# EAGLE design mainboard (EAGLE 8.2.2)
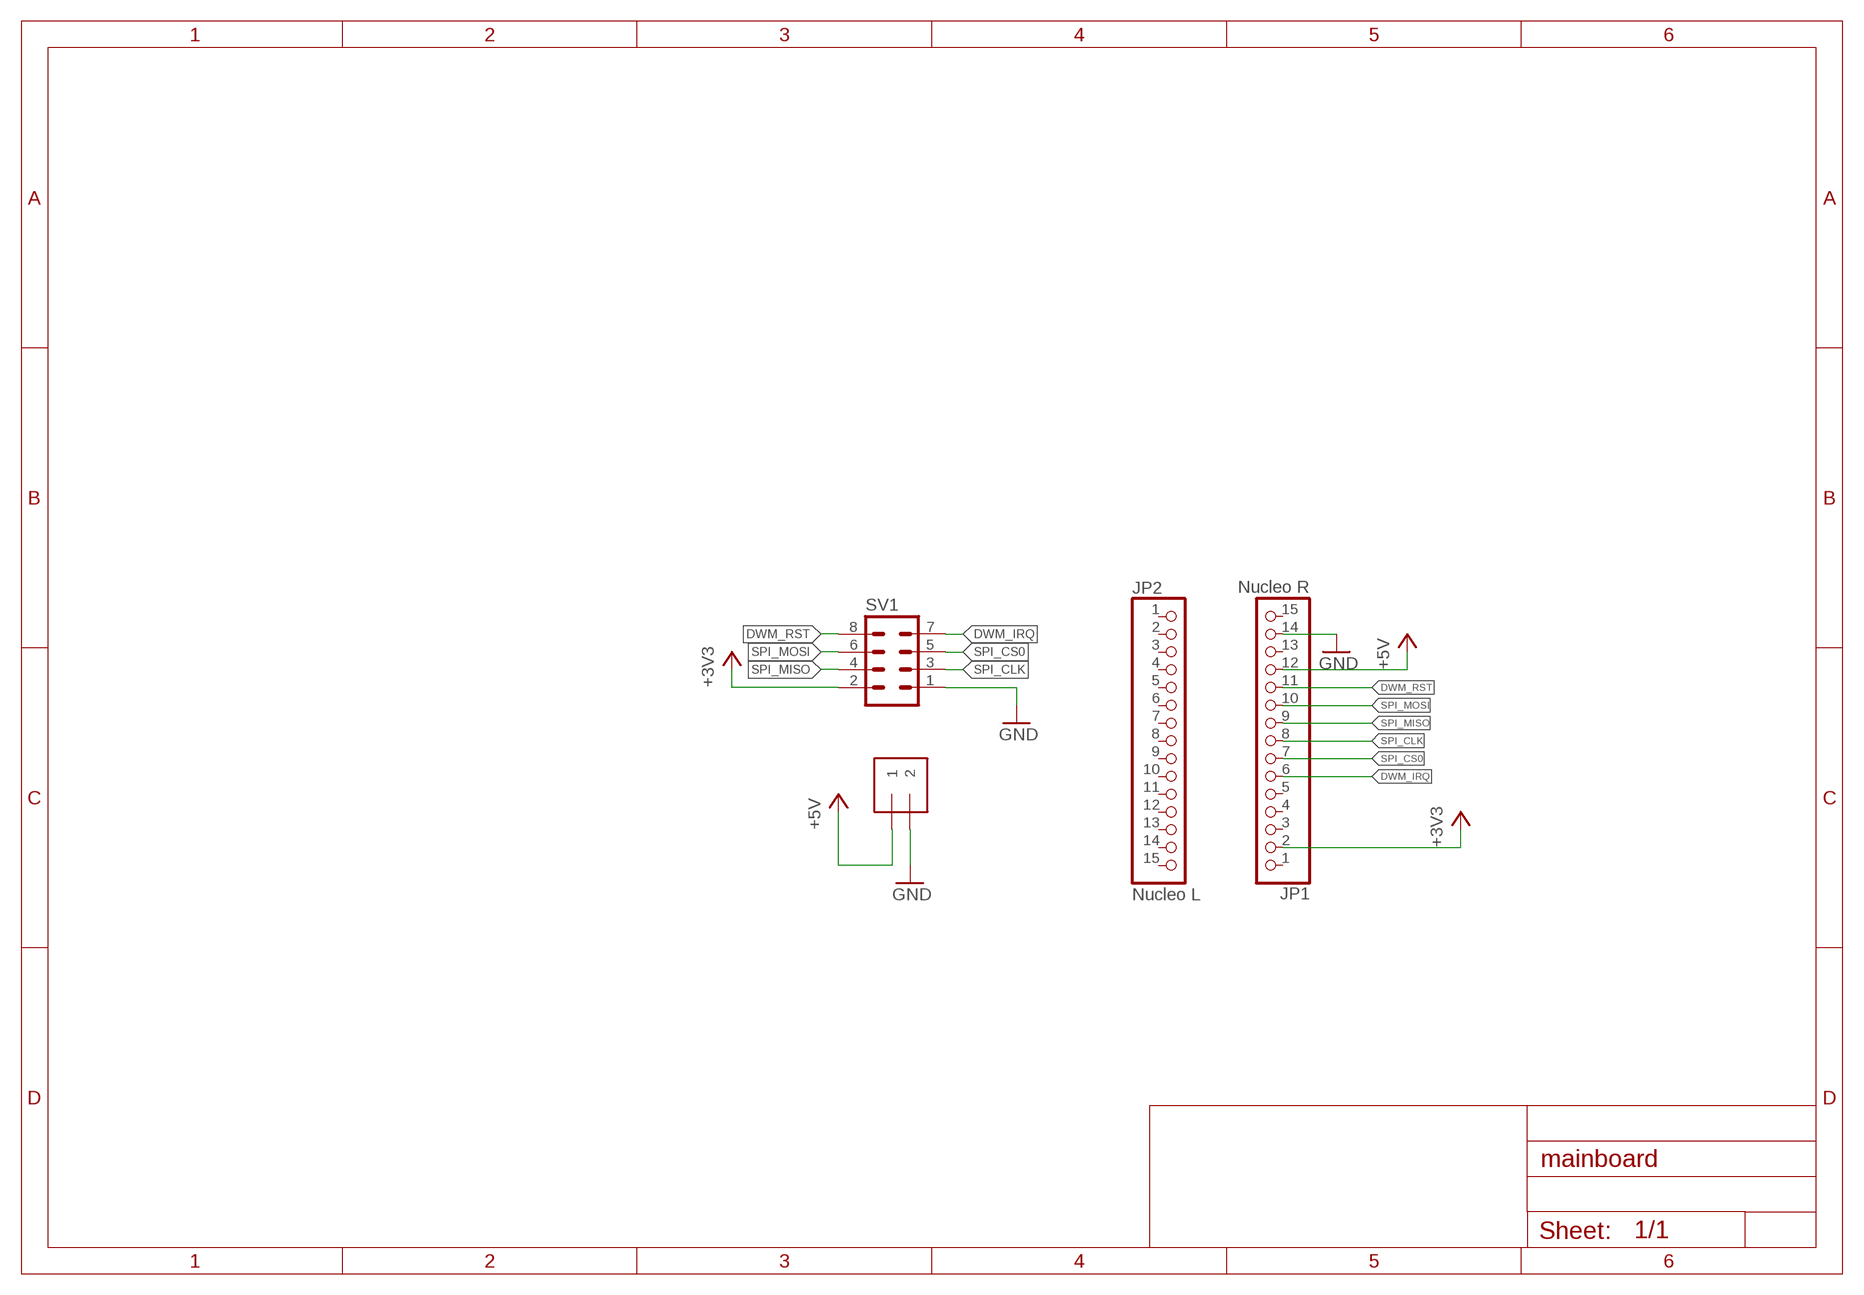
[diagram p0: schematic, sheet 1]

## Parts
J1  1X2-3.5MM  [1X2-3.5MM]
JP1  Nucleo R  PINHD-1X15  [1X15]
JP2  Nucleo L  PINHD-1X15  [1X15]
SV1  MA04-2  [MA04-2]

## Nets
+3V3: JP1.2 SV1.2
+5V: J1.1 JP1.12
DWM_IRQ: JP1.6 SV1.7
DWM_RST: JP1.11 SV1.8
GND: J1.2 JP1.14 SV1.1
SPI_CLK: JP1.8 SV1.3
SPI_CS0: JP1.7 SV1.5
SPI_MISO: JP1.9 SV1.4
SPI_MOSI: JP1.10 SV1.6
Unconnected: JP1.1 JP1.3 JP1.4 JP1.5 JP1.13 JP1.15 JP2.1 JP2.2 JP2.3 JP2.4 JP2.5 JP2.6 JP2.7 JP2.8 JP2.9 JP2.10 JP2.11 JP2.12 JP2.13 JP2.14 JP2.15

## Library data of the parts
J1 = adafruit:1X2: 3.5mm Terminal block http://www.ladyada.net/library/pcb/eaglelibrary.html
JP1 JP2 = pinhead:PINHD-1X15: PIN HEADER
SV1 = con-lstb:MA04-2: PIN HEADER; OC_FARNELL: unknown; OC_NEWARK: unknown

## Net classes
0 default: clearance 0.205 mm

## Board
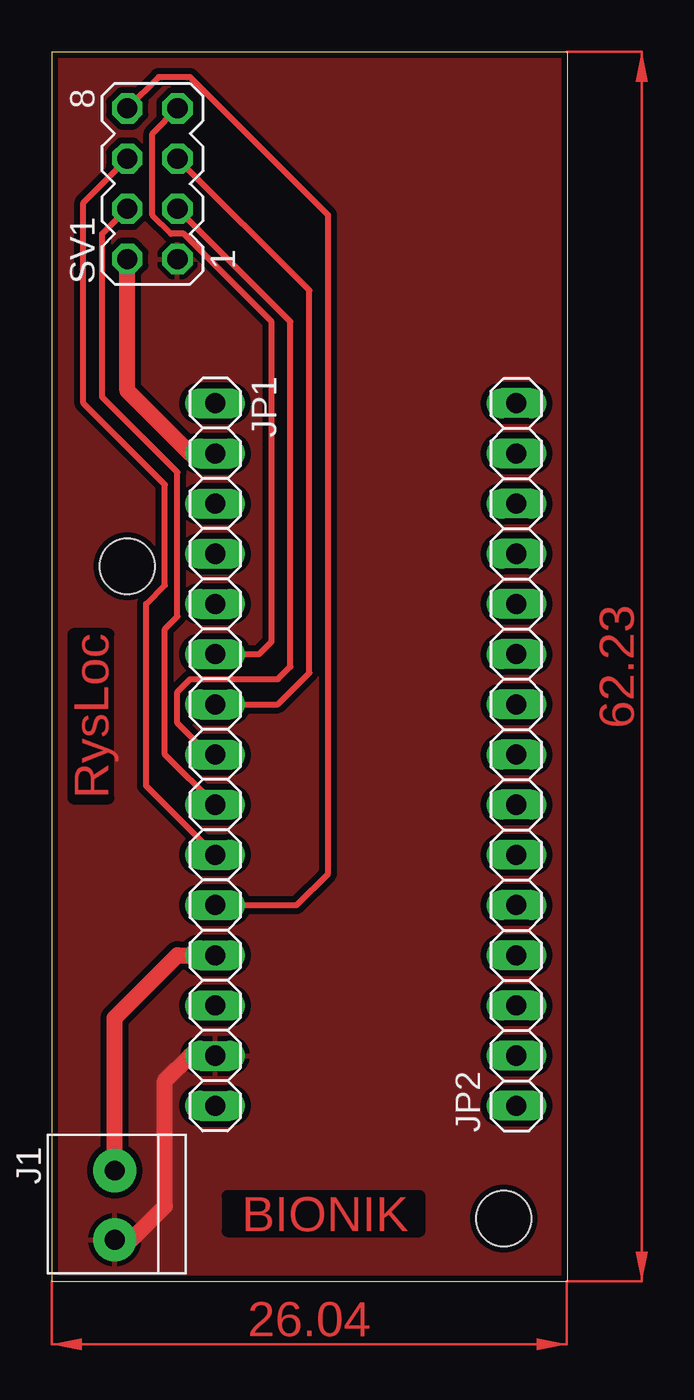
[diagram p1: board, top side]
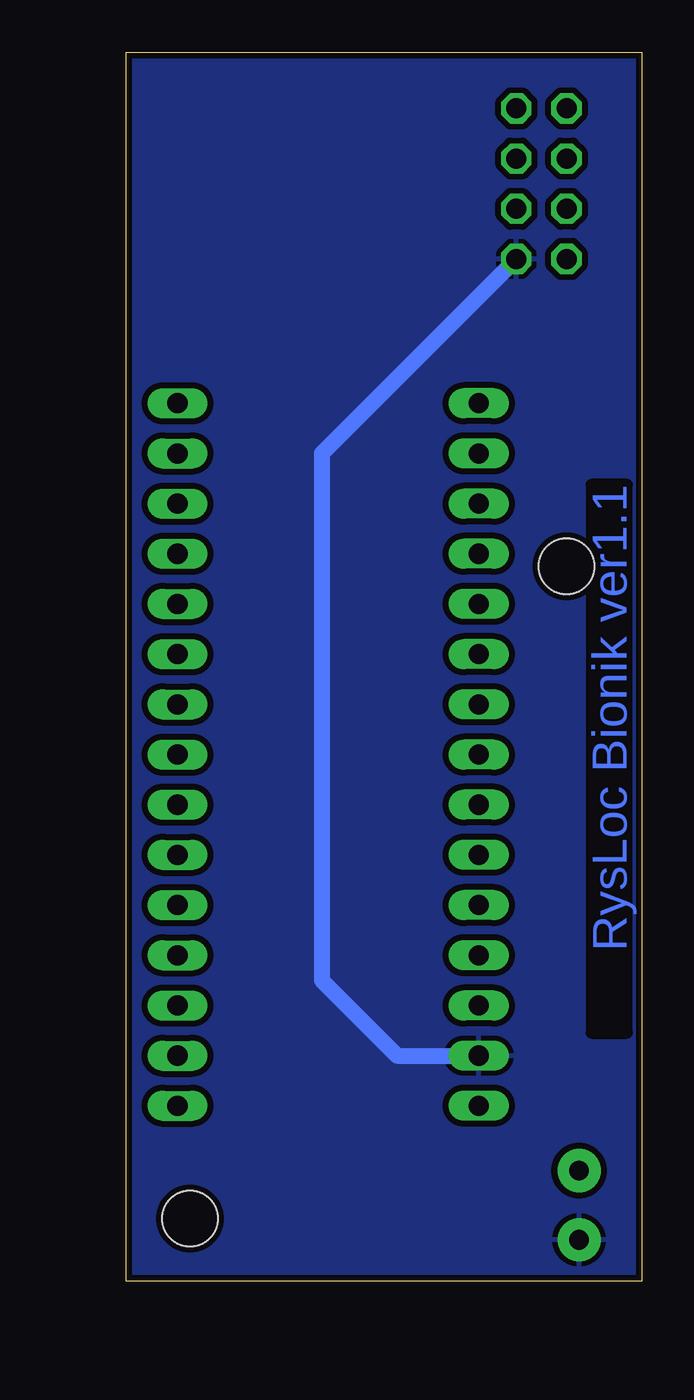
[diagram p2: board, bottom side, seen from below]

Size 26.09 x 62.22 mm. Coordinates in mm from the lower left corner, seen from the top.
Outline: 0,0 26.09,0 26.09,62.22 0,62.22 0,0
Copper layers (1*16): Top 0.035mm / dielectric 1.5mm / Bottom 0.035mm
Design rules "default *": minimum track width 10mil, minimum drill 24mil, track to track 8mil, track to pad 8mil, pad to pad 8mil, via to via 8mil, smd to smd 8mil, copper to edge 8mil, drill to drill 8mil, minimum pad ring 8mil, minimum via ring 8mil, stop-mask expansion 4mil, vias tented up to drill 0mil, thermal gap 10mil
Holes 2.8 mm at 22.86,3.17 3.81,36.2

### Footprints (pad centres in the part's own frame; a part is rotated, then mirrored left to right if it is on the bottom)
1X2-3.5MM = drill 1 pad 2.184: 1 1.8,0; 2 -1.7,0
1X15 = drill 1.016 long: 1 -17.78,0; 2 -15.24,0; 3 -12.7,0; 4 -10.16,0; 5 -7.62,0; 6 -5.08,0; 7 -2.54,0; 8 0,0; 9 2.54,0; 10 5.08,0; 11 7.62,0; 12 10.16,0; 13 12.7,0; 14 15.24,0; 15 17.78,0
MA04-2 = drill 1.016 octagon: 1 -3.81,-1.27; 2 -3.81,1.27; 3 -1.27,-1.27; 4 -1.27,1.27; 5 1.27,-1.27; 6 1.27,1.27; 7 3.81,-1.27; 8 3.81,1.27

### Placement (x,y rotation side)
J1  3.18,3.81 90 top
JP1  8.26,26.67 270 top
JP2  23.5,26.67 90 top
SV1  5.08,55.56 90 top

### Tracks (layer width: path | path; a pad name or v marks a point on that pad's centre or on a via)
+3V3
  Top 0.813: JP1.2 6.99,41.91 3.81,45.09 SV1.2
+5V
  Top 0.813: J1.1 3.18,13.33 6.35,16.51 JP1.12
DWM_IRQ
  Top 0.305: JP1.6 10.48,31.75 11.11,32.39 11.11,48.58 6.67,53.02 6.03,53.02 5.08,53.98 5.08,58.1 SV1.7
DWM_RST
  Top 0.305: JP1.11 12.38,19.05 13.97,20.64 13.97,53.98 6.99,60.96 5.4,60.96 SV1.8
GND
  Top 0.813: J1.2 4.02,2.11 5.72,3.81 5.72,10.16 6.99,11.43 JP1.14
  Bottom 0.813: SV1.1 16.19,41.91 16.19,15.24 12.38,11.43 JP1.14
  pour Top (isolate 0.305): 0,62.23 0,0 26.04,0 26.04,62.23
  pour Bottom (isolate 0.305): 0,62.23 0,0 26.04,0 26.04,62.23
SPI_CLK
  Top 0.305: JP1.8 7.94,26.67 6.35,28.26 6.35,29.85 6.99,30.48 11.43,30.48 12.07,31.11 12.07,48.58 SV1.3
SPI_CS0
  Top 0.305: JP1.7 11.43,29.21 13.02,30.8 13.02,50.16 SV1.5
SPI_MISO
  Top 0.305: JP1.9 5.72,26.67 5.72,33.02 6.35,33.66 6.35,40.96 2.54,44.77 2.54,53.02 SV1.4
SPI_MOSI
  Top 0.305: JP1.10 4.76,25.08 4.76,34.29 5.72,35.24 5.72,40.32 1.59,44.45 1.59,54.61 SV1.6
(copper drawn outside any net)
  shapes: Top area x2

### Text on the board
Top: RysLoc | BIONIK
Bottom: RysLoc Bionik ver1.1